# EAGLE design 3tastsp_v5_resistorcooldrive_battcheck (EAGLE 7.5.0)
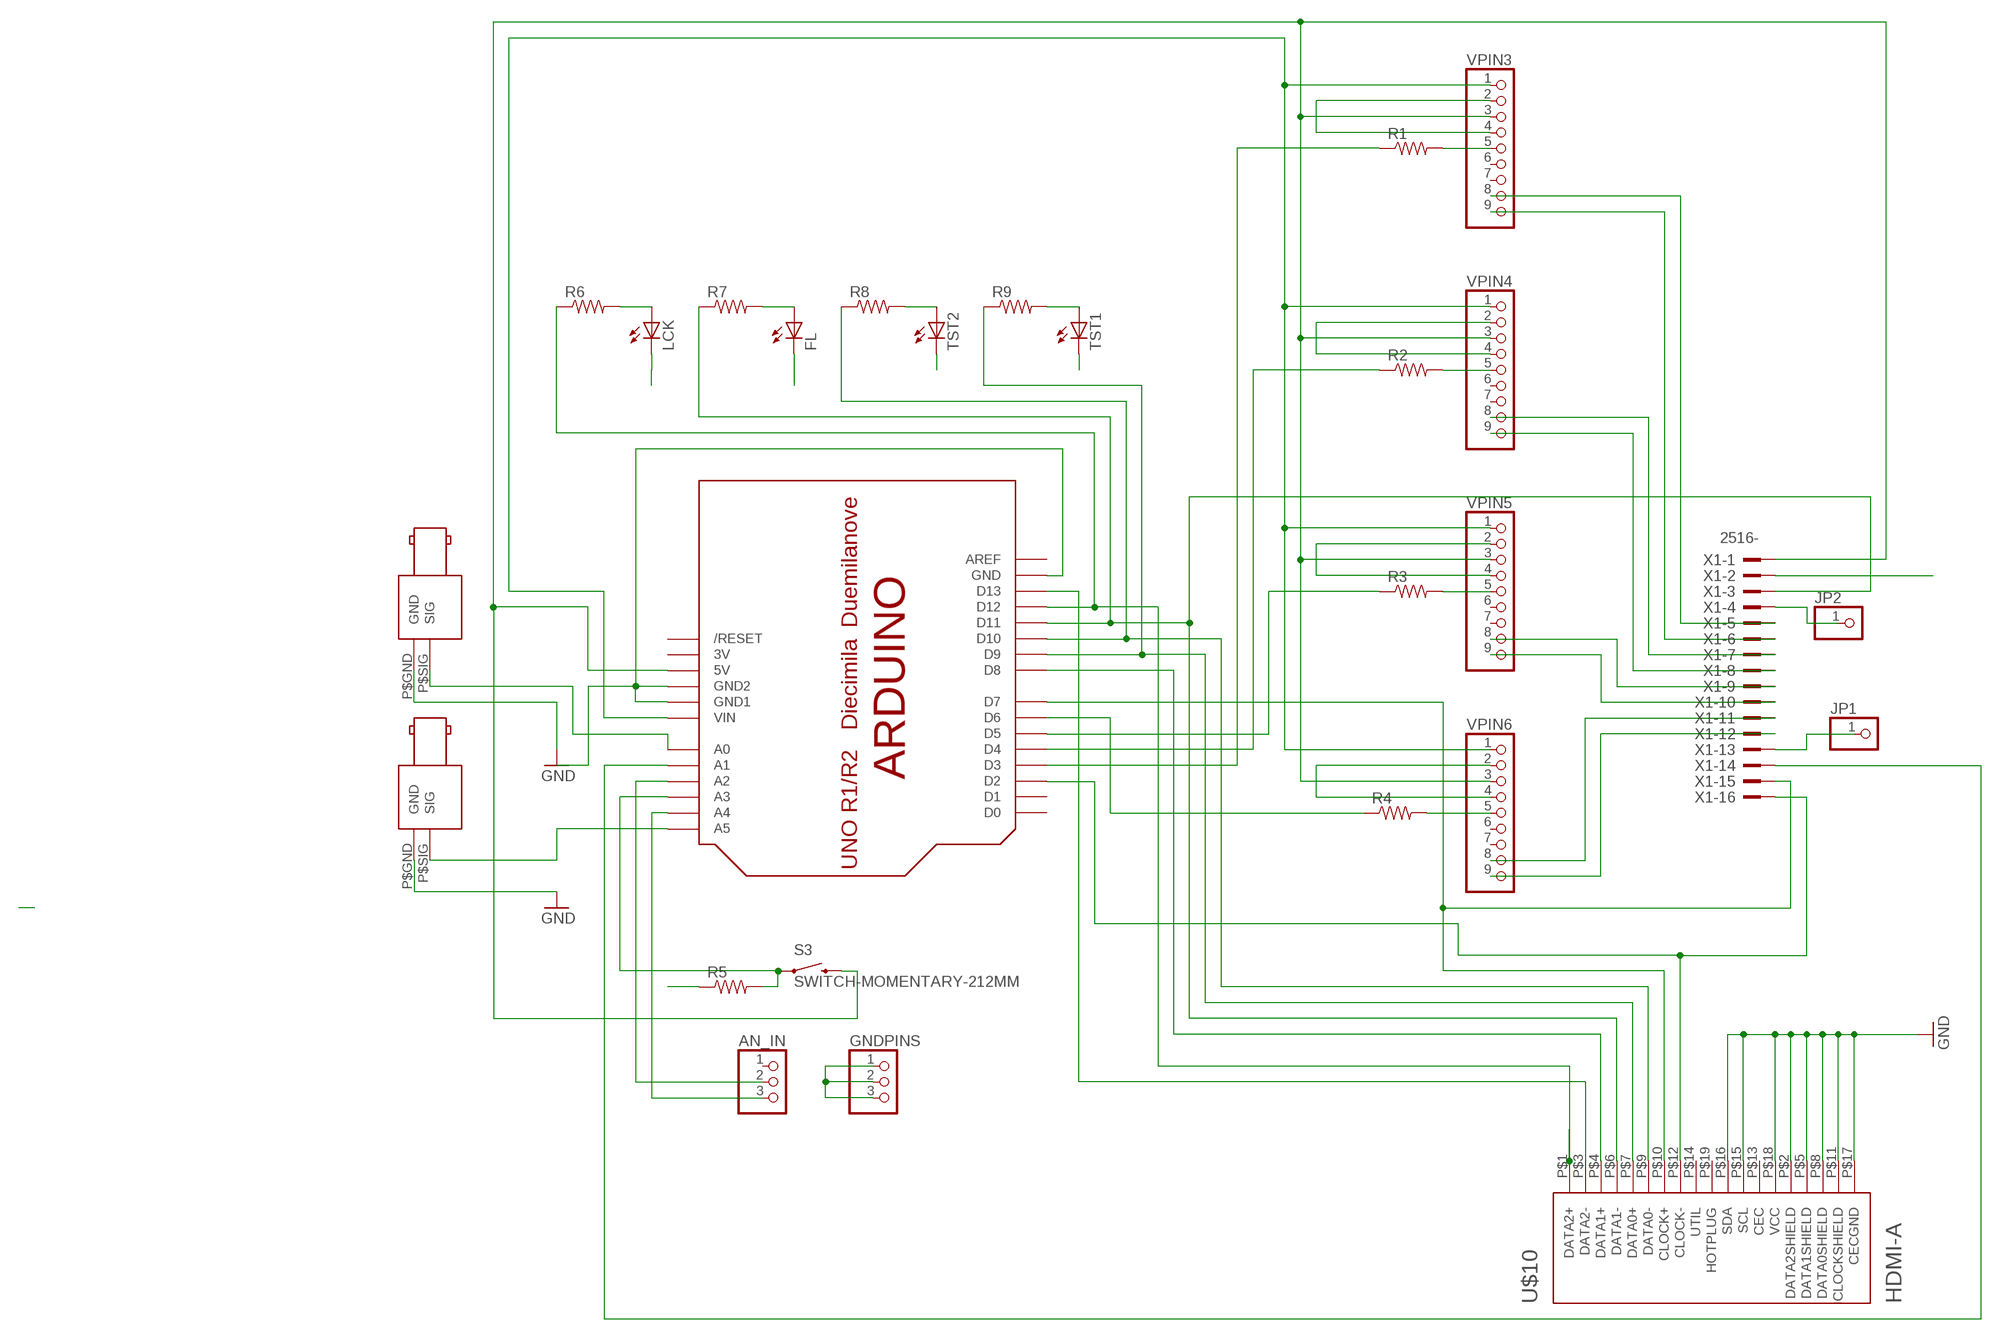
[diagram p0: schematic, sheet 1]

## Parts
AN_IN  PINHD-1X3  [1X03]
FL  LED5MM  [LED5MM]
GNDPINS  PINHD-1X3  [1X03]
JP1  PINHD-1X1  [1X01]
JP2  PINHD-1X1  [1X01]
LCK  LED5MM  [LED5MM]
LICKSIG  BNC_RIGHT_ANGLE  [BNC_RIGHT_ANGLE]
R1  1KOHM-1/4W-1%(PTH)HORIZ-KIT  [AXIAL-0.3EZ]
R2  1KOHM-1/4W-1%(PTH)HORIZ-KIT  [AXIAL-0.3EZ]
R3  1KOHM-1/4W-1%(PTH)HORIZ-KIT  [AXIAL-0.3EZ]
R4  1KOHM-1/4W-1%(PTH)HORIZ-KIT  [AXIAL-0.3EZ]
R5  1KOHM-1/4W-1%(PTH)HORIZ-KIT  [AXIAL-0.3EZ]
R6  1KOHM-1/4W-1%(PTH)HORIZ-KIT  [AXIAL-0.3EZ]
R7  1KOHM-1/4W-1%(PTH)HORIZ-KIT  [AXIAL-0.3EZ]
R8  1KOHM-1/4W-1%(PTH)HORIZ-KIT  [AXIAL-0.3EZ]
R9  1KOHM-1/4W-1%(PTH)HORIZ-KIT  [AXIAL-0.3EZ]
S3  SWITCH-MOMENTARY-212MM  [TACTILE-PTH-12MM]
TRIALSIG  BNC_RIGHT_ANGLE  [BNC_RIGHT_ANGLE]
TST1  LED5MM  [LED5MM]
TST2  LED5MM  [LED5MM]
U$1  ARDUINO-NOHOLE  [ARDUINO-NOHOLE]
U$10  HDMI-A  [HDMI_A]
VPIN3  PINHD-1X9  [1X09]
VPIN4  PINHD-1X9  [1X09]
VPIN5  PINHD-1X9  [1X09]
VPIN6  PINHD-1X9  [1X09]
X1  2516-  [PAK100/2500-16]

## Nets
D6: U$1.D13 U$10.P$3(DATA2-)
D7: R6.P$1 U$1.D12 U$10.P$1(DATA2+)
D8: U$1.D8 U$10.P$4(DATA1+)
D9: R7.P$1 U$1.D11 U$10.P$6(DATA1-) X1.3
D10: R9.P$1 U$1.D9 U$10.P$7(DATA0+)
D11: R8.P$1 U$1.D10 U$10.P$9(DATA0-)
D12: U$1.D7 U$10.P$10(CLOCK+) X1.15
D13: U$1.D2 U$10.P$12(CLOCK-) X1.16
GND: FL.K(C) GNDPINS.1 GNDPINS.2 GNDPINS.3 LCK.K(C) LICKSIG.P$GND(GND) R5.P$1 TRIALSIG.P$GND(GND) TST1.K(C) TST2.K(C) U$1.GND U$1.GND1 U$1.GND2 U$10.P$2(DATA2SHIELD) U$10.P$5(DATA1SHIELD) U$10.P$8(DATA0SHIELD) U$10.P$11(CLOCKSHIELD) U$10.P$15(SCL) U$10.P$16(SDA) U$10.P$17(CECGND) U$10.P$18(VCC) VPIN3.2 VPIN3.4 VPIN4.2 VPIN4.4 VPIN5.2 VPIN5.4 VPIN6.2 VPIN6.4 X1.2
N$1: S3.3 U$1.5V VPIN3.3 VPIN4.3 VPIN5.3 VPIN6.3 X1.1
N$2: TRIALSIG.P$SIG(SIG) U$1.A5
N$3: LICKSIG.P$SIG(SIG) U$1.A0
N$4: LCK.A R6.P$2
N$5: FL.A R7.P$2
N$7: R8.P$2 TST2.A
N$8: R9.P$2 TST1.A
N$9: R1.P$2 VPIN3.5
N$10: AN_IN.3 U$1.A4
N$11: AN_IN.2 U$1.A2
N$12: R2.P$2 VPIN4.5
N$13: R4.P$1 U$1.D6
N$14: R3.P$1 U$1.D5
N$15: R2.P$1 U$1.D4
N$16: R1.P$1 U$1.D3
N$17: JP2.1 X1.4
N$18: R5.P$2 S3.1 U$1.A3
N$19: U$1.VIN VPIN3.1 VPIN4.1 VPIN5.1 VPIN6.1
N$20: VPIN3.8 X1.5
N$21: VPIN3.9 X1.6
N$22: VPIN4.8 X1.7
N$23: VPIN4.9 X1.8
N$24: VPIN5.9 X1.10
N$25: VPIN5.8 X1.9
N$26: VPIN6.8 X1.11
N$27: VPIN6.9 X1.12
N$28: R3.P$2 VPIN5.5
N$29: R4.P$2 VPIN6.5
N$30: U$1.A1 X1.14
N$31: JP1.1 X1.13
Unconnected: AN_IN.1 U$1.AREF U$1.D0 U$1.D1 U$1.RESET(/RESET) U$10.P$13(CEC) U$10.P$14(UTIL) U$10.P$19(HOTPLUG) VPIN3.6 VPIN3.7 VPIN4.6 VPIN4.7 VPIN5.6 VPIN5.7 VPIN6.6 VPIN6.7

## Power pins joined to a net without a drawn wire
3V: U$1.3V

## Library data of the parts
AN_IN GNDPINS = pinhead:PINHD-1X3: PIN HEADER
FL LCK TST1 TST2 = led:LED: LED OSRAM: - CHIPLED LG R971, LG N971, LY N971, LG Q971, LY Q971, LO R971, LY R971 LH N974, LH R974 LS Q976, LO Q976, LY Q976 LO Q996 - Hyper CHIPLED LW Q18S LB Q993, LB Q99A, LB R99A - SideLED LS A670, LO A670, LY A670, LG A670, LP A670 LB A673, LV A673, LT A673, LW A673 LH A674 LY A675 LS A676, LA A676, LO A676, LY A676, LW A676 LS A679, LY A679, LG A679 - Hyper Micro SIDELED® LS Y876, LA Y876, LO Y876, LY Y876 LT Y87S - SmartLED LW L88C, LW L88S LB L89C, LB L89S, LG L890 LS L89K, LO L89K, LY L89K LS L896, LA L896, LO L896, LY L896 - TOPLED LS T670, LO T670, LY T670, LG T670, LP T670 LSG T670, LSP T670, LSY T670, LOP T670, LYG T670 LG T671, LOG T671, LSG T671 LB T673, LV T673, LT T673, LW T673 LH T674 LS T676, LA T676, LO T676, LY T676, LB T676, LH T676, LSB T676, LW T676 LB T67C, LV T67C, LT T67C, LS T67K, LO T67K, LY T67K, LW E67C LS E67B, LA E67B, LO E67B, LY E67B, LB E67C, LV E67C, LT E67C LW T67C LS T679, LY T679, LG T679 LS T770, LO T770, LY T770, LG T770, LP T770 LB T773, LV T773, LT T773, LW T773 LH T774 LS E675, LA E675, LY E675, LS T675 LS T776, LA T776, LO T776, LY T776, LB T776 LHGB T686 LT T68C, LB T68C - Hyper Mini TOPLED® LB M676 - Mini TOPLED Santana® LG M470 LS M47K, LO M47K, LY M47K Source: http://www.osram.convergy.de LUXEON: - LUMILED® LXK2-PW12-R00, LXK2-PW12-S00, LXK2-PW14-U00, LXK2-PW14-V00 LXK2-PM12-R00, LXK2-PM12-S00, LXK2-PM14-U00 LXK2-PE12-Q00, LXK2-PE12-R00, LXK2-PE12-S00, LXK2-PE14-T00, LXK2-PE14-U00 LXK2-PB12-K00, LXK2-PB12-L00, LXK2-PB12-M00, LXK2-PB14-N00, LXK2-PB14-P00, LXK2-PB14-Q00 LXK2-PR12-L00, LXK2-PR12-M00, LXK2-PR14-Q00, LXK2-PR14-R00 LXK2-PD12-Q00, LXK2-PD12-R00, LXK2-PD12-S00 LXK2-PH12-R00, LXK2-PH12-S00 LXK2-PL12-P00, LXK2-PL12-Q00, LXK2-PL12-R00 Source: www.luxeon.com KINGBRIGHT: KA-3528ASYC Source: www.kingbright.com
JP1 JP2 = pinhead:PINHD-1X1: PIN HEADER
LICKSIG TRIALSIG = connectors:BNC_RIGHT_ANGLE: BNC plug, through-hole, right-angle
R1-R9 = SparkFun-Resistors:1KOHM-1/4W-1%(PTH): RES-12182; PROD_ID: RES-12182; VALUE: 1K
S3 = SparkFun-Electromechanical:SWITCH-MOMENTARY-2: Various NO switches- pushbuttons, reed, etc; PROD_ID: SWCH-09185
U$1 = ARDUINO_nohole:ARDUINO: Arduino Diecimila/Duemilanove Make a shield with ease, this package has all the named pins as well as the two mounting drill holes and an outline of the USB and DC power connector. The outline is on the DIMENSION layer, so if your board house uses it they will cut the outline to match. http://www.ladyada.net/library/pcb/eaglelibrary.html
U$10 = connectors:HDMI-A: Horizonal HDMI type "A" jack
VPIN3-VPIN6 = pinhead:PINHD-1X9: PIN HEADER
X1 = con-3m:2516-: 3M (TM) Pak 100 4-Wall Header Source: 3M; OC_FARNELL: unknown; OC_NEWARK: unknown

## Board
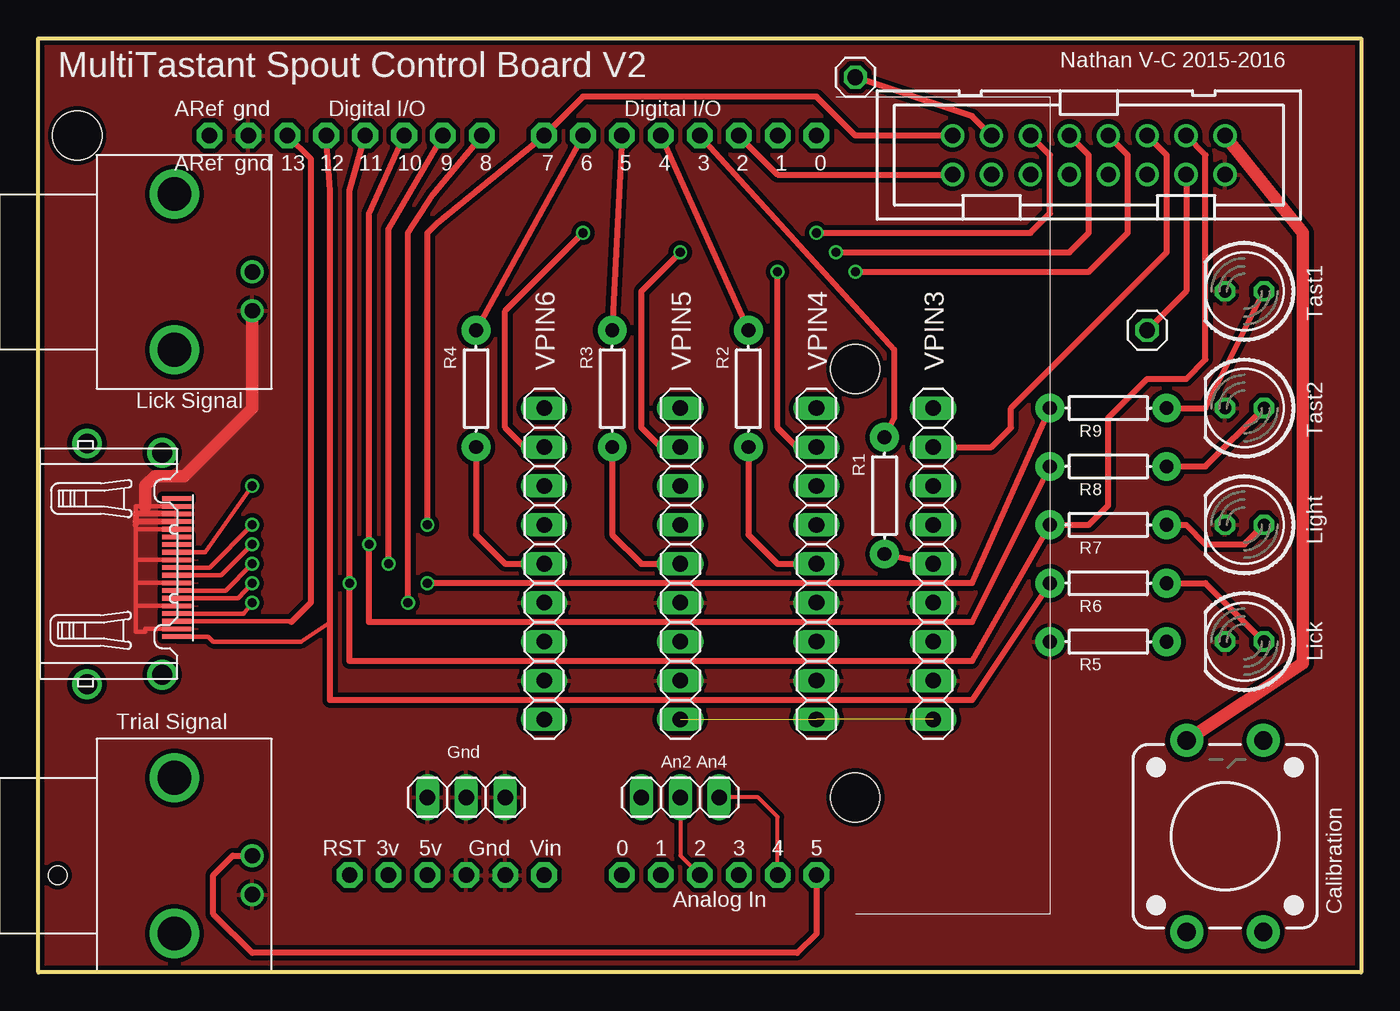
[diagram p1: board, top side]
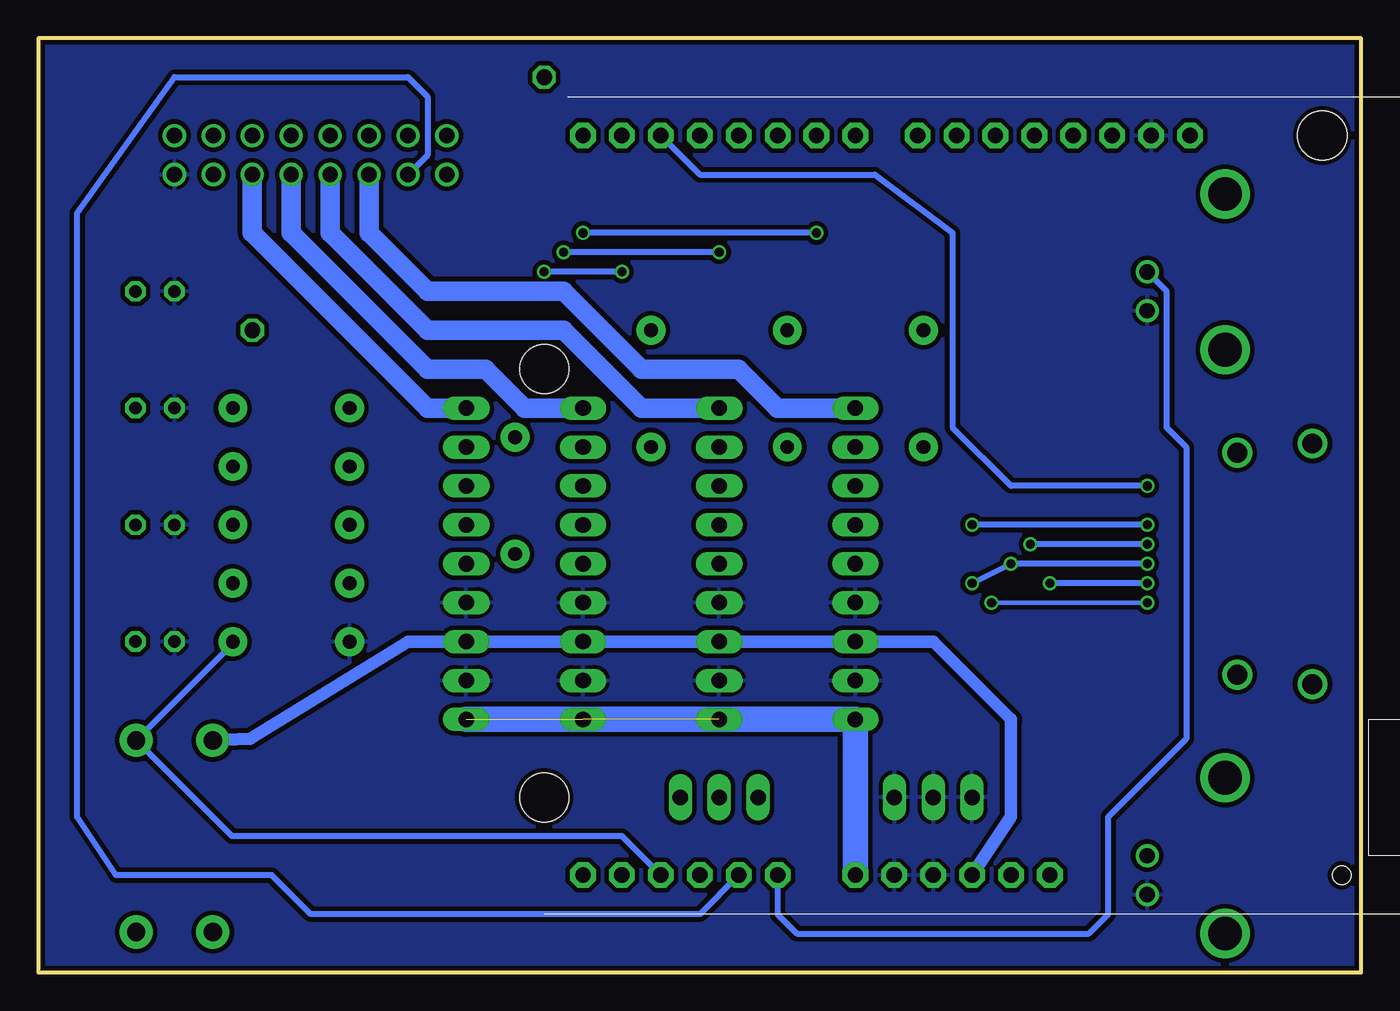
[diagram p2: board, bottom side, seen from below]

Size 86.36 x 60.96 mm. Coordinates in mm from the lower left corner, seen from the top.
Outline: 0,0 0,60.96 86.36,60.96 86.36,0 0,0
Copper layers (1*16): Top 0.035mm / dielectric 1.5mm / Bottom 0.035mm
Design rules "SeeedStudio_2layer_DRU_no_angle_20140221": minimum track width 6mil, minimum drill 12mil, track to track 6mil, track to pad 6mil, pad to pad 6mil, via to via 6mil, smd to smd 0mil, copper to edge 10mil, drill to drill 10mil, minimum pad ring 10mil, minimum via ring 6mil, stop-mask expansion 2mil, vias tented up to drill 100mil, thermal gap 10mil
Holes 3.2 mm at 2.54,54.61 53.34,39.37 53.34,11.43
Holes 1.2 mm at 1.27,6.35

### Footprints (pad centres in the part's own frame; a part is rotated, then mirrored left to right if it is on the bottom)
1X03 = drill 1.016 long: 1 -2.54,0; 2 0,0; 3 2.54,0
LED5MM = drill 0.813 octagon: A -1.27,0; K 1.27,0
1X01 = drill 1.016 octagon: 1 0,0
BNC_RIGHT_ANGLE = drill 2.2: P$1 -5.08,-6.35; P$2 5.08,-6.35 | drill 1: P$GND -2.54,-11.43; P$SIG 0,-11.43
AXIAL-0.3EZ = drill 0.9 pad 1.88: P$1 -3.81,0; P$2 3.81,0
TACTILE-PTH-12MM = drill 1.2 pad 2.159: 1 6.25,-2.5; 2 -6.25,-2.5; 3 6.25,2.5; 4 -6.25,2.5
ARDUINO-NOHOLE = drill 1 pad 1.676 octagon: 3V 35.56,2.54; 5V 38.1,2.54; A0 50.8,2.54; A1 53.34,2.54; A2 55.88,2.54; A3 58.42,2.54; A4 60.96,2.54; A5 63.5,2.54; AREF 23.876,50.8; D0 63.5,50.8; D1 60.96,50.8; D2 58.42,50.8; D3 55.88,50.8; D4 53.34,50.8; D5 50.8,50.8; D6 48.26,50.8; D7 45.72,50.8; D8 41.656,50.8; D9 39.116,50.8; D10 36.576,50.8; D11 34.036,50.8; D12 31.496,50.8; D13 28.956,50.8; GND 26.416,50.8; GND1 43.18,2.54; GND2 40.64,2.54; RESET 33.02,2.54; VIN 45.72,2.54
HDMI_A = smd 0.3 x 1.9: P$1 4.75,3.95; P$2 4.25,3.95; P$3 3.75,3.95; P$4 3.25,3.95; P$5 2.75,3.95; P$6 2.25,3.95; P$7 1.75,3.95; P$8 1.25,3.95; P$9 0.75,3.95; P$10 0.25,3.95; P$11 -0.25,3.95; P$12 -0.75,3.95; P$13 -1.25,3.95; P$14 -1.75,3.95; P$15 -2.25,3.95; P$16 -2.75,3.95; P$17 -3.25,3.95; P$18 -3.75,3.95; P$19 -4.25,3.95 | drill 1.3: P$20 -7.25,3; P$21 7.25,3; P$22 7.85,-1.9; P$23 -7.85,-1.9
1X09 = drill 1.016 long: 1 -10.16,0; 2 -7.62,0; 3 -5.08,0; 4 -2.54,0; 5 0,0; 6 2.54,0; 7 5.08,0; 8 7.62,0; 9 10.16,0
PAK100/2500-16 = drill 1 pad 1.422: 1 -8.89,-1.27; 2 -8.89,1.27; 3 -6.35,-1.27; 4 -6.35,1.27; 5 -3.81,-1.27; 6 -3.81,1.27; 7 -1.27,-1.27; 8 -1.27,1.27; 9 1.27,-1.27; 10 1.27,1.27; 11 3.81,-1.27; 12 3.81,1.27; 13 6.35,-1.27; 14 6.35,1.27; 15 8.89,-1.27; 16 8.89,1.27

### Placement (x,y rotation side)
AN_IN  41.91,11.43 0 top
FL  78.74,29.21 180 top
GNDPINS  27.94,11.43 0 top
JP1  53.34,58.42 0 top
JP2  72.39,41.91 0 top
LCK  78.74,21.59 180 top
LICKSIG  2.54,45.72 90 top
R1  55.24,31.11 270 top
R2  46.35,38.1 270 top
R3  37.47,38.1 270 top
R4  28.57,38.1 270 top
R5  69.85,21.59 0 top
R6  69.85,25.4 0 top
R7  69.85,29.21 0 top
R8  69.85,33.02 0 top
R9  69.85,36.83 0 top
S3  77.47,8.89 90 top
TRIALSIG  2.54,7.62 90 top
TST1  78.74,44.45 180 top
TST2  78.74,36.83 180 top
U$1  -12.7,3.81 0 top
U$10  5.08,26.67 270 top
VPIN3  58.42,26.67 90 top
VPIN4  50.8,26.67 90 top
VPIN5  41.91,26.67 90 top
VPIN6  33.02,26.67 90 top
X1  68.58,53.34 180 top

### Tracks (layer width: path | path; a pad name or v marks a point on that pad's centre or on a via)
D6
  Top 0.305: 16.51,22.86 16.45,22.92 U$10.P$3
  Top 0.406: U$1.D13 17.78,53.09 17.78,24.13 16.51,22.86
D7
  Top 0.305: U$10.P$1 11.1,21.92 11.43,21.59 17.14,21.59 19.05,22.86
  Top 0.406: R6.P$1 60.96,17.78 19.05,17.78 19.05,22.86 19.05,51.05 U$1.D12
D8  (via drill 0.6)
  Top 0.305: U$10.P$4 13.41,23.42 v13.97,24.13
  Top 0.406: v24.13,24.13 24.13,48.26 25.78,50.8 U$1.D8
  Bottom 0.305: v13.97,24.13 v24.13,24.13
D9  (via drill 0.6)
  Top 0.305: U$10.P$6 13.04,24.42 v13.97,25.4
  Top 0.406: 21.34,54.36 U$1.D11 20.32,51.05 v20.32,25.4 20.32,20.32 60.96,20.32 R7.P$1 68.58,29.21 69.85,30.48 69.85,36.2 72.39,38.73 74.93,38.73 76.2,40.01 76.2,53.34 X1.3
  Bottom 0.406: v13.97,25.4 v20.32,25.4
D10  (via drill 0.6)
  Top 0.305: U$10.P$7 12.22,24.92 v13.97,26.67
  Top 0.406: v22.86,26.67 22.86,48.51 U$1.D9 | R9.P$1 60.96,25.4 v25.4,25.4
  Bottom 0.406: v13.97,26.67 v22.86,26.67 v25.4,25.4
D11  (via drill 0.6)
  Top 0.305: U$10.P$9 11.95,25.92 v13.97,27.94
  Top 0.406: U$1.D10 21.59,49.53 v21.59,27.94 21.59,22.86 60.96,22.86 R8.P$1
  Bottom 0.406: v13.97,27.94 v21.59,27.94
D12  (via drill 0.6)
  Top 0.305: U$10.P$10 11.18,26.42 v13.97,29.21
  Top 0.406: X1.15 53.34,54.61 50.8,57.15 35.56,57.15 U$1.D7 26.04,48.9 25.4,48.26 v25.4,29.21
  Bottom 0.406: v13.97,29.21 v25.4,29.21
D13  (via drill 0.6)
  Top 0.305: U$10.P$12 10.91,27.42 v13.97,31.75
  Top 0.406: U$1.D2 48.26,52.07 X1.16
  Bottom 0.406: U$1.D2 43.18,52.07 31.75,52.07 26.67,48.26 26.67,35.56 22.86,31.75 v13.97,31.75
GND
  Top 0.305: 6.35,28.92 6.35,26.92 | 6.35,26.92 6.35,25.42 | 6.35,25.42 6.35,23.92 | 6.35,23.92 6.35,22.23 6.99,22.23 6.99,22.42 U$10.P$2 | U$10.P$5 6.35,23.92 | U$10.P$15 6.35,28.92 | U$10.P$11 6.35,26.92 | U$10.P$8 6.35,25.42 | U$10.P$18 6.99,30.42 6.35,30.42 6.35,29.21 6.35,28.92
  Top 0.406: U$10.P$17 6.35,29.92 6.35,29.42 | U$10.P$16 6.35,29.42 | 6.35,29.42 6.35,29.21
  Top 0.813: LICKSIG.P$GND 13.97,36.83 9.53,32.38 7.62,32.38 6.99,31.75 6.99,30.42
  pour Bottom (isolate 0.305): 0,60.96 0,0 86.36,0 86.36,3.81 86.36,60.96
  pour Top (isolate 0.305): 0,60.96 0,0 86.36,0 86.36,60.96
N$1
  Top 0.813: X1.1 82.55,48.26 82.55,20.18 S3.3
  Bottom 0.813: U$1.5V 22.86,10.16 22.86,16.51 27.94,21.59 VPIN6.3 VPIN5.3 VPIN4.3 VPIN3.3 62.23,21.59 72.53,15.24 S3.3
N$2
  Top 0.406: U$1.A5 50.8,2.54 49.53,1.27 13.97,1.27 11.43,3.81 11.43,6.35 12.7,7.62 TRIALSIG.P$SIG
N$3
  Bottom 0.406: U$1.A0 38.1,3.81 36.83,2.54 17.78,2.54 16.51,3.81 16.51,10.16 11.43,15.24 11.43,34.29 12.7,35.56 12.7,44.45 LICKSIG.P$SIG
N$4
  Top 0.406: R6.P$2 76.2,25.4 LCK.A
N$5
  Top 0.406: R7.P$2 74.93,29.21 76.2,27.94 78.74,27.94 FL.A
N$7
  Top 0.406: R8.P$2 76.2,33.02 TST2.A
N$8
  Top 0.406: R9.P$2 76.2,36.83 TST1.A
N$9
  Top 0.406: R1.P$2 VPIN3.5
N$10
  Top 0.254: U$1.A4 48.26,10.16 46.99,11.43 AN_IN.3
N$11
  Top 0.254: AN_IN.2 41.91,7.62 U$1.A2
N$12
  Top 0.406: R2.P$2 46.35,28.57 48.26,26.67 VPIN4.5
N$13
  Top 0.406: U$1.D6 R4.P$1
N$14
  Top 0.406: U$1.D5 R3.P$1
N$15
  Top 0.406: U$1.D4 R2.P$1
N$16
  Top 0.406: R1.P$1 55.88,36.2 55.88,40.64 U$1.D3
N$17
  Top 0.406: X1.4 74.93,44.45 JP2.1
N$18
  Bottom 0.406: R5.P$2 73.66,21.45 S3.1 73.72,8.89 48.26,8.89 U$1.A3
N$19  (2 unrouted)
  Bottom 1.676: U$1.VIN VPIN6.1 VPIN3.1
N$20
  Top 0.406: VPIN3.8 62.23,34.29 63.5,35.56 63.5,36.83 73.66,46.99 73.66,53.34 X1.5
N$21
  Bottom 1.27: VPIN3.9 60.96,36.83 72.39,48.26 X1.6
N$22  (via drill 0.6)
  Top 0.406: VPIN4.8 49.53,34.29 48.26,35.56 v48.26,45.72 | v53.34,45.72 68.58,45.72 71.12,48.26 71.12,53.34 X1.7
  Bottom 0.406: v48.26,45.72 v53.34,45.72
N$23
  Bottom 1.27: VPIN4.9 54.61,36.83 57.15,39.37 60.96,39.37 69.85,48.26 X1.8
N$24
  Bottom 1.27: VPIN5.9 46.99,36.83 52.07,41.91 60.96,41.91 67.31,48.26 X1.10
N$25  (via drill 0.6)
  Top 0.406: VPIN5.8 40.64,34.29 39.37,35.56 39.37,44.45 v41.91,46.99 | v52.07,46.99 67.31,46.99 68.58,48.26 68.58,53.34 X1.9
  Bottom 0.406: v41.91,46.99 v52.07,46.99
N$26  (via drill 0.6)
  Top 0.406: VPIN6.8 31.75,34.29 30.48,35.56 30.48,43.18 v35.56,48.26 | v50.8,48.26 64.77,48.26 66.04,49.53 66.04,53.34 X1.11
  Bottom 0.406: v35.56,48.26 v50.8,48.26
N$27
  Bottom 1.27: VPIN6.9 38.1,36.83 40.64,39.37 46.99,39.37 52.07,44.45 60.96,44.45 64.77,48.26 X1.12
N$28
  Top 0.406: R3.P$2 37.47,28.57 39.37,26.67 VPIN5.5
N$29
  Top 0.406: R4.P$2 28.57,28.57 30.48,26.67 VPIN6.5
N$30
  Bottom 0.406: U$1.A1 43.18,3.81 68.58,3.81 71.12,6.35 81.28,6.35 83.82,10.16 83.82,49.53 77.47,58.42 62.23,58.42 60.96,57.15 60.96,53.34 X1.14
N$31
  Top 0.406: X1.13 60.96,55.88 JP1.1

### Text on the board
tPlace: Gnd
tNames: Nathan V-C 2015-2016 | MultiTastant Spout Control Board V2 | ARef | gnd | Tast1 | R4 | R3 | R2 | Lick Signal | R9 | Tast2 | R1 | R8 | Light | R7 | R6 | R5 | Lick | Trial Signal | An2 An4 | Calibration